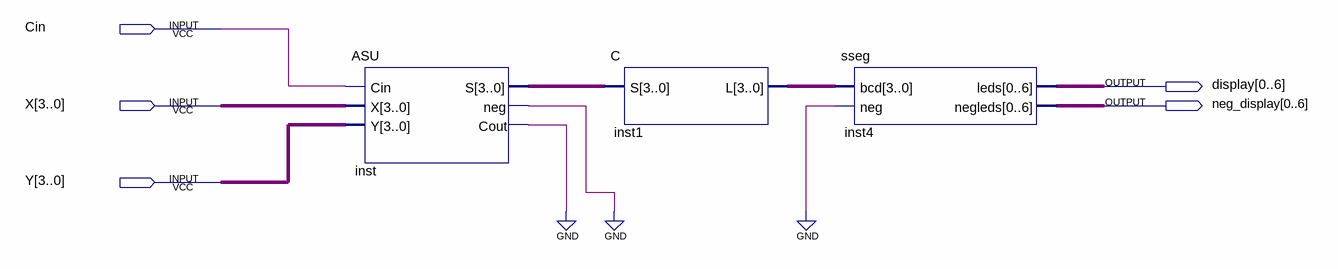
[diagram p0: schematic sheet]
// Quartus schematic CombinedASU2.bdf as structural Verilog: 3 symbols, 5 pins
module CombinedASU2 (
  input  Cin,
  input  [3:0] X,
  input  [3:0] Y,
  output [0:6] display,
  output [0:6] neg_display
);

  wire inst_cout, inst_neg;
  wire [3:0] inst1_l, inst_s;

  ASU inst (.Cin(Cin), .X(X), .Y(Y), .S(inst_s), .neg(inst_neg), .Cout(inst_cout));
  C inst1 (.S(inst_s), .L(inst1_l));
  sseg inst4 (.bcd(inst1_l), .neg(1'b0), .leds(display), .negleds(neg_display));
  // also tied to GND on the sheet: {inst_cout, inst_neg}
endmodule
